# Altium project MCU.PrjPcb
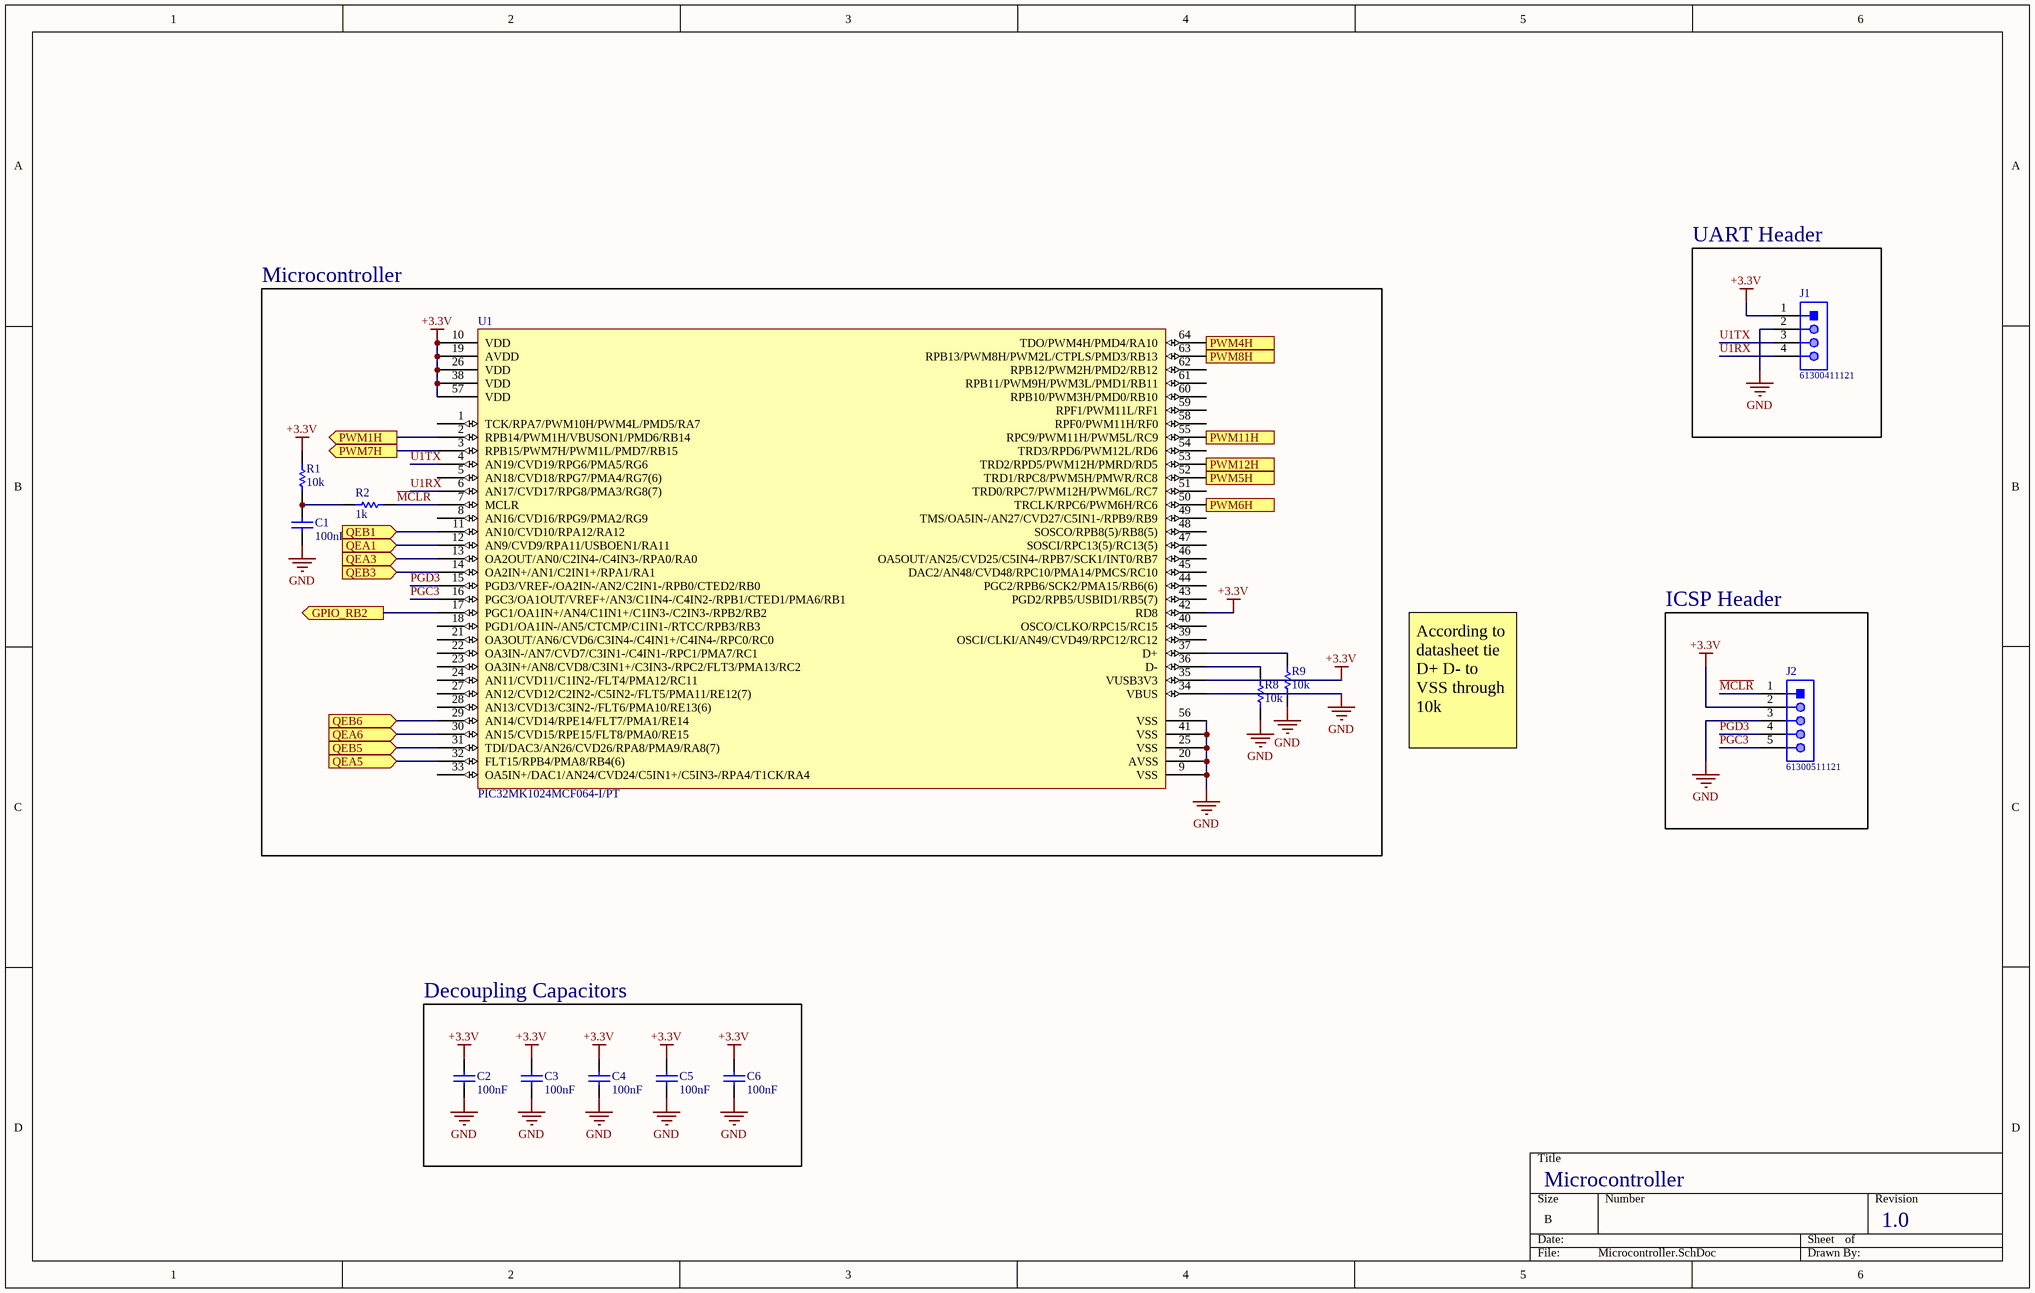
[diagram p0: Microcontroller.SchDoc]
2 sheets, 30 parts. Net scope: flat (ports and power ports of the same name join across sheets).
Board file: MCU.PcbDoc
Sheets:
  Microcontroller.SchDoc
  Motors.SchDoc

## Sheet Microcontroller.SchDoc
size B

### Parts
C1  100nF  [0402]
C2  100nF  [0402]
C3  100nF  [0402]
C4  100nF  [0402]
C5  100nF  [0402]
C6  100nF  [0402]
J1  61300411121  [61300411121]
J2  61300511121  [61300511121]
R1  10k  [0402]
R2  1k  [0402]
R8  10k  [0402]
R9  10k  [0402]
U1  PIC32MK1024MCF064-I/PT  [64-TQFP]

### Blocks framed on the sheet
UART Header: J1
Microcontroller: C1 R1 R2 R8 R9 U1
ICSP Header: J2
Decoupling Capacitors: C2-C6

### Ports
GPIO_RB2 (out), PWM1H (out), PWM4H (out), PWM5H (out), PWM6H (out), PWM7H (out), PWM8H (out), PWM11H (out), PWM12H (out), QEA1 (in), QEA3 (in), QEA5 (in), QEA6 (in), QEB1 (in), QEB3 (in), QEB5 (in), QEB6 (in)

### Nets
+3.3V: C2.2 C3.2 C4.2 C5.2 C6.2 J1.1 J2.2 R1.2 U1.10(VDD) U1.19(AVDD) U1.26(VDD) U1.35(VUSB3V3) U1.38(VDD) U1.42(RD8) U1.57(VDD)
GND: C1.1 C2.1 C3.1 C4.1 C5.1 C6.1 J1.2 J2.3 R8.1 R9.1 U1.9(VSS) U1.20(AVSS) U1.25(VSS) U1.34(VBUS) U1.41(VSS) U1.56(VSS)
~{MCLR}: J2.1 R2.2 U1.7(MCLR)
PGC3: J2.5 U1.16(PGC3/OA1OUT/VREF+/AN3/C1IN4-/C4IN2-/RPB1/CTED1/PMA6/RB1)
PGD3: J2.4 U1.15(PGD3/VREF-/OA2IN-/AN2/C2IN1-/RPB0/CTED2/RB0)
U1RX: J1.4 U1.6(AN17/CVD17/RPG8/PMA3/RG8(7))
U1TX: J1.3 U1.4(AN19/CVD19/RPG6/PMA5/RG6)
NetC1_2: C1.2 R1.1 R2.1
NetR8_2: R8.2 U1.36(D-)
NetR9_2: R9.2 U1.37(D+)
NetU1_2: U1.2(RPB14/PWM1H/VBUSON1/PMD6/RB14) ; port PWM1H
NetU1_3: U1.3(RPB15/PWM7H/PWM1L/PMD7/RB15) ; port PWM7H
NetU1_11: U1.11(AN10/CVD10/RPA12/RA12) ; port QEB1
NetU1_12: U1.12(AN9/CVD9/RPA11/USBOEN1/RA11) ; port QEA1
NetU1_13: U1.13(OA2OUT/AN0/C2IN4-/C4IN3-/RPA0/RA0) ; port QEA3
NetU1_14: U1.14(OA2IN+/AN1/C2IN1+/RPA1/RA1) ; port QEB3
NetU1_17: U1.17(PGC1/OA1IN+/AN4/C1IN1+/C1IN3-/C2IN3-/RPB2/RB2) ; port GPIO_RB2
NetU1_29: U1.29(AN14/CVD14/RPE14/FLT7/PMA1/RE14) ; port QEB6
NetU1_30: U1.30(AN15/CVD15/RPE15/FLT8/PMA0/RE15) ; port QEA6
NetU1_31: U1.31(TDI/DAC3/AN26/CVD26/RPA8/PMA9/RA8(7)) ; port QEB5
NetU1_32: U1.32(FLT15/RPB4/PMA8/RB4(6)) ; port QEA5
NetU1_50: U1.50(TRCLK/RPC6/PWM6H/RC6) ; port PWM6H
NetU1_52: U1.52(TRD1/RPC8/PWM5H/PMWR/RC8) ; port PWM5H
NetU1_53: U1.53(TRD2/RPD5/PWM12H/PMRD/RD5) ; port PWM12H
NetU1_55: U1.55(RPC9/PWM11H/PWM5L/RC9) ; port PWM11H
NetU1_63: U1.63(RPB13/PWM8H/PWM2L/CTPLS/PMD3/RB13) ; port PWM8H
NetU1_64: U1.64(TDO/PWM4H/PMD4/RA10) ; port PWM4H

Not connected (* = marked no-connect by the designer): U1 1(TCK/RPA7/PWM10H/PWM4L/PMD5/RA7) 5(AN18/CVD18/RPG7/PMA4/RG7(6)) 8(AN16/CVD16/RPG9/PMA2/RG9) 18(PGD1/OA1IN-/AN5/CTCMP/C1IN1-/RTCC/RPB3/RB3) 21(OA3OUT/AN6/CVD6/C3IN4-/C4IN1+/C4IN4-/RPC0/RC0) 22(OA3IN-/AN7/CVD7/C3IN1-/C4IN1-/RPC1/PMA7/RC1) 23(OA3IN+/AN8/CVD8/C3IN1+/C3IN3-/RPC2/FLT3/PMA13/RC2) 24(AN11/CVD11/C1IN2-/FLT4/PMA12/RC11) 27(AN12/CVD12/C2IN2-/C5IN2-/FLT5/PMA11/RE12(7)) 28(AN13/CVD13/C3IN2-/FLT6/PMA10/RE13(6)) 33(OA5IN+/DAC1/AN24/CVD24/C5IN1+/C5IN3-/RPA4/T1CK/RA4) 39(OSCI/CLKI/AN49/CVD49/RPC12/RC12) 40(OSCO/CLKO/RPC15/RC15) 43(PGD2/RPB5/USBID1/RB5(7)) 44(PGC2/RPB6/SCK2/PMA15/RB6(6)) 45(DAC2/AN48/CVD48/RPC10/PMA14/PMCS/RC10) 46(OA5OUT/AN25/CVD25/C5IN4-/RPB7/SCK1/INT0/RB7) 47(SOSCI/RPC13(5)/RC13(5)) 48(SOSCO/RPB8(5)/RB8(5)) 49(TMS/OA5IN-/AN27/CVD27/C5IN1-/RPB9/RB9) 51(TRD0/RPC7/PWM12H/PWM6L/RC7) 54(TRD3/RPD6/PWM12L/RD6) 58(RPF0/PWM11H/RF0) 59(RPF1/PWM11L/RF1) 60(RPB10/PWM3H/PMD0/RB10) 61(RPB11/PWM9H/PWM3L/PMD1/RB11) 62(RPB12/PWM2H/PMD2/RB12)

### Notes on the sheet
- According to datasheet tie D+ D- to VSS through 10k
- Microcontroller
- 1.0

### Library data of the parts
C1-C6 = C1005X7R1C104K050BC: TDK - C1005X7R1C104K050BC. - CERAMIC CAPACITOR, 0.1UF, 16V, X7R, 10%, 0402, FULL REEL; Part Name: C1005X7R1C104K050BC; Supplier 1: Digi-Key; Supplier Part Number 1: 445-4952-1-ND; Manufacturer: TDK; Manufacturer Part Number: C1005X7R1C104K050BC; RoHS: Yes; Category: Ceramic Capacitors; Stock 1: 2957810; Pricing 1: 1=0.10000, 10=0.07500, 100=0.03350, 500=0.02390, 1000=0.01879, 2500=0.01708, 5000=0.01571 (USD); Mount: Surface Mount; Case/Package: 0402; Min Operating Temperature: -55°C; Max Operating Temperature: 125°C; Termination: SMD/SMT; Voltage: 16V; Tolerance: 10%; Capacitance: 100nF; Packaging: Tape and Reel; Voltage Rating: 16V; Package Quantity: 1; Voltage Rating (DC): 16V; Length: 1mm; Height: 0.5mm; Radiation Hardening: No; REACH SVHC: Unknown; Number of Pins: 2; Weight: 2.3E-05oz; Case Code (Metric): 1005; Case Code (Imperial): 0402; Dielectric Material: Ceramic; Dielectric: X7R; Composition: Ceramic; Depth: 0.5mm; Thickness: 0.022inch; Width: 0.02inch; Lead Free: Lead Free
J1 = CMP-1502-01064-1: THT Vertical Pin Header WR-PHD, Pitch 2.54 mm, Single Row, 4 pins; Manufacturer: Wurth Elektronik; Withstanding Voltage: 500VAC; Rated Current: 3A; Working Voltage: 250VAC; Pin Number: 4; Gender: Male; Contact Resistance: 20mOhm; Pitch: 2.54mm; Manufacturer URL: http://www.we-online.de; Operating Temperature: -40to105degC; Packaging: Bag; Mounting Technology: THT; Package Reference: 61300411121; Datasheet URL: https://katalog.we-online.de/em/datasheet/6130xx11121.pdf; Publisher: WurthElektronik; Part Number: 61300411121; Row Number: Single; Orientation: Vertical
J2 = CMP-1502-01068-1: THT Vertical Pin Header WR-PHD, Pitch 2.54 mm, Single Row, 5 pins; Manufacturer: Wurth Elektronik; Pin Number: 5; Contact Resistance: 20mOhm; Working Voltage: 250VAC; Pitch: 2.54mm; Withstanding Voltage: 500VAC; Rated Current: 3A; Gender: Male; Datasheet URL: https://katalog.we-online.de/em/datasheet/6130xx11121.pdf; Orientation: Vertical; Mounting Technology: THT; Row Number: Single; Package Reference: 61300511121; Publisher: WurthElektronik; Part Number: 61300511121; Packaging: Bag; Manufacturer URL: http://www.we-online.de; Operating Temperature: -40to105degC
R1 R8 R9 = CRCW040210K0FKEDC: D10/CRCW0402-C 100 10K 1% ET7; Manufacturer: Vishay; Power Rating: 62.5mW; Temperature Coefficient: 100ppm/°C; Part Name: CRCW040210K0FKEDC; Supplier 1: Digi-Key; Supplier Part Number 1: 541-3959-6-ND; Manufacturer Part Number: CRCW040210K0FKEDC; RoHS: Yes; Category: Resistors; Stock 1: 3541307; Pricing 1: 1=0.10000, 10=0.03200, 100=0.01300, 1000=0.00583, 2500=0.00506, 5000=0.00418 (USD); Case/Package: Molded; Contact Plating: Tin; Min Operating Temperature: -55°C; Max Operating Temperature: 155°C; Tolerance: 1%; Termination: Wraparound; Resistance: 10k; Composition: Thick Film; Length: 1mm; Lead Free: Lead Free
R2 = CRCW04021K00FKED: Res Thick Film 0402 1K Ohm 1% 1/16W ±100ppm/°C Molded SMD Paper T/R; Manufacturer: Vishay Dale; Part Name: CRCW04021K00FKED; Supplier 1: Digi-Key; Supplier Part Number 1: 541-1.00KLDKR-ND; Manufacturer Part Number: CRCW04021K00FKED; RoHS: Yes; Category: Chip SMD Resistors; Stock 1: 767306; Pricing 1: 1=0.10000, 10=0.03600, 100=0.01460, 1000=0.00657, 2500=0.00570, 5000=0.00471 (USD); Tolerance: 1%; Resistance: 1k
U1 = PIC32MK1024MCF064-I/PT: IC MCU 32BIT 1MB FLASH 64TQFP; Manufacturer: Microchip; Part Name: PIC32MK1024MCF064-I/PT; Supplier 1: Digi-Key; Supplier Part Number 1: PIC32MK1024MCF064-I/PT-ND; Manufacturer Part Number: PIC32MK1024MCF064-I/PT; RoHS: No; Category: Microcontrollers; Stock 1: 2; Pricing 1: 1=7.30000, 25=6.70000, 100=6.06000 (USD); ComponentLink1URL: http://www.farnell.com/datasheets/2302007.pdf?src-supplier=Farnell; ComponentLink1Description: http://www.farnell.com/datasheets/2302007.pdf?src-supplier=Farnell; ComponentLink2URL: http://www.microchip.com/mymicrochip/filehandler.aspx?ddocname=en597535&src-supplier=Digi-Key; ComponentLink2Description: http://www.microchip.com/mymicrochip/filehandler.aspx?ddocname=en597535&src-supplier=Digi-Key

## Sheet Motors.SchDoc
size B
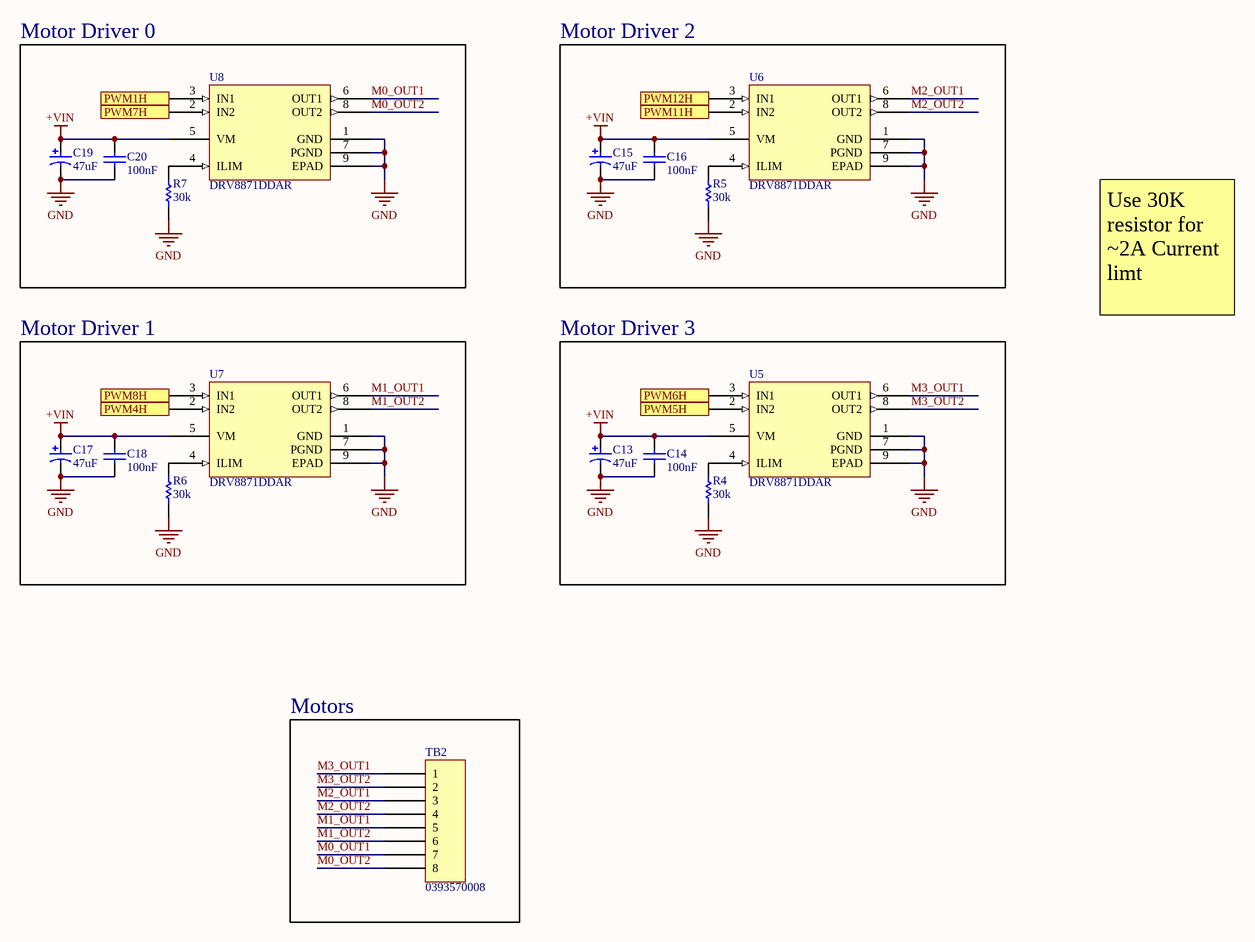
[diagram p1: Motors.SchDoc]

### Parts
C13  47uF  [EEE-FT1C470AR]
C14  100nF  [0402]
C15  47uF  [EEE-FT1C470AR]
C16  100nF  [0402]
C17  47uF  [EEE-FT1C470AR]
C18  100nF  [0402]
C19  47uF  [EEE-FT1C470AR]
C20  100nF  [0402]
R4  30k  [0402]
R5  30k  [0402]
R6  30k  [0402]
R7  30k  [0402]
TB2  0393570008  [0393570008]
U5  DRV8871DDAR  [8-HSOP]
U6  DRV8871DDAR  [8-HSOP]
U7  DRV8871DDAR  [8-HSOP]
U8  DRV8871DDAR  [8-HSOP]

### Blocks framed on the sheet
Motor Driver 0: C19 C20 R7 U8
Motor Driver 2: C15 C16 R5 U6
Motor Driver 1: C17 C18 R6 U7
Motor Driver 3: C13 C14 R4 U5
Motors: TB2

### Ports
PWM1H (in), PWM4H (in), PWM5H (in), PWM6H (in), PWM7H (in), PWM8H (in), PWM11H (in), PWM12H (in)

### Nets
+VIN: C13.1 C14.2 C15.1 C16.2 C17.1 C18.2 C19.1 C20.2 U5.5(VM) U6.5(VM) U7.5(VM) U8.5(VM)
GND: C13.2 C14.1 C15.2 C16.1 C17.2 C18.1 C19.2 C20.1 R4.1 R5.1 R6.1 R7.1 U5.1(GND) U5.7(PGND) U5.9(EPAD) U6.1(GND) U6.7(PGND) U6.9(EPAD) U7.1(GND) U7.7(PGND) U7.9(EPAD) U8.1(GND) U8.7(PGND) U8.9(EPAD)
M0_OUT1: TB2.7 U8.6(OUT1)
M0_OUT2: TB2.8 U8.8(OUT2)
M1_OUT1: TB2.5 U7.6(OUT1)
M1_OUT2: TB2.6 U7.8(OUT2)
M2_OUT1: TB2.3 U6.6(OUT1)
M2_OUT2: TB2.4 U6.8(OUT2)
M3_OUT1: TB2.1 U5.6(OUT1)
M3_OUT2: TB2.2 U5.8(OUT2)
NetR4_2: R4.2 U5.4(ILIM)
NetR5_2: R5.2 U6.4(ILIM)
NetR6_2: R6.2 U7.4(ILIM)
NetR7_2: R7.2 U8.4(ILIM)
NetU1_2: U8.3(IN1) ; port PWM1H
NetU1_3: U8.2(IN2) ; port PWM7H
NetU1_50: U5.3(IN1) ; port PWM6H
NetU1_52: U5.2(IN2) ; port PWM5H
NetU1_53: U6.3(IN1) ; port PWM12H
NetU1_55: U6.2(IN2) ; port PWM11H
NetU1_63: U7.3(IN1) ; port PWM8H
NetU1_64: U7.2(IN2) ; port PWM4H

### Notes on the sheet
- Use 30K resistor for ~2A Current limt
- Title
- Size:
- Date:
- B
- Number:
- Time:
- Revision:
- Sheet
- of
- File:

### Library data of the parts
C13 C15 C17 C19 = EEE-FT1C470AR: PANASONIC - EEEFT1C470AR - SMD Aluminium Electrolytic Capacitor, Radial Can - SMD, 47 µF, 16 V, 0.85 ohm, FT Series; Polarity: Polar; Voltage: 16V; Leakage Current: 7.5uA; Life (Hours): 2000Hour; Tolerance: 20%; Ripple Current: 160mA; ESR (Equivalent Series Resistance): 850mR; Lead Diameter: 0.65mm; Part Name: EEE-FT1C470AR; Supplier 1: Digi-Key; Supplier Part Number 1: P15090CT-ND; Manufacturer: Panasonic; Manufacturer Part Number: EEEFT1C470AR; RoHS: Yes; Category: Aluminum Electrolytic Capacitors; Stock 1: 48806; Pricing 1: 1=0.42000, 10=0.29800, 100=0.19590, 500=0.14514, 1000=0.12337 (USD); Mount: Surface Mount; Case/Package: Radial; Contact Plating: Tin; Min Operating Temperature: -55°C; Max Operating Temperature: 105°C; Termination: SMD/SMT; Capacitance: 47uF; Packaging: Tape and Reel; Voltage Rating: 16V; Ripple Current (AC): 160mA; Package Quantity: 2000; Voltage Rating (DC): 16V; Diameter: 4mm; Length: 5.8mm; Height: 5.8mm; Lead Pitch: 1mm; Height - Seated (Max): 0.24inch; Radiation Hardening: No; REACH SVHC: No SVHC
C14 C16 C18 C20 = C1005X7R1C104K050BC: as C1 on sheet Microcontroller; Part Name: C1005X7R1C104K050BC; Supplier 1: Digi-Key; Supplier Part Number 1: 445-4952-1-ND; Manufacturer: TDK; Manufacturer Part Number: C1005X7R1C104K050BC; RoHS: Yes; Category: Ceramic Capacitors; Stock 1: 2957810; Pricing 1: 1=0.10000, 10=0.07500, 100=0.03350, 500=0.02390, 1000=0.01879, 2500=0.01708, 5000=0.01571 (USD); Mount: Surface Mount; Case/Package: 0402; Min Operating Temperature: -55°C; Max Operating Temperature: 125°C; Termination: SMD/SMT; Voltage: 16V; Tolerance: 10%; Capacitance: 100nF; Packaging: Tape and Reel; Voltage Rating: 16V; Package Quantity: 1; Voltage Rating (DC): 16V; Length: 1mm; Height: 0.5mm; Radiation Hardening: No; REACH SVHC: Unknown; Number of Pins: 2; Weight: 2.3E-05oz; Case Code (Metric): 1005; Case Code (Imperial): 0402; Dielectric Material: Ceramic; Dielectric: X7R; Composition: Ceramic; Depth: 0.5mm; Thickness: 0.022inch; Width: 0.02inch; Lead Free: Lead Free
R4-R7 = CRCW040230K0FKED: Res Thick Film 0402 30K Ohm 1% 0.063W(1/16W) ±100ppm/C Molded SMD Automotive Paper T/R; Manufacturer: Vishay; Power Rating: 63mW; Temperature Coefficient: 100ppm/°C; Voltage Rating: 50V; Part Name: CRCW040230K0FKED; Supplier 1: Digi-Key; Supplier Part Number 1: 541-30.0KLCT-ND; Manufacturer Part Number: CRCW040230K0FKED; RoHS: Yes; Category: Chip SMD Resistors; Stock 1: 3845; Pricing 1: 1=0.10000, 10=0.03600, 100=0.01460, 1000=0.00657, 2500=0.00570, 5000=0.00471 (USD); Case/Package: 0402; Weight: 2.3E-05oz; Case Code (Metric): 1005; Case Code (Imperial): 0402; Contact Plating: Tin; Min Operating Temperature: -55°C; Max Operating Temperature: 155°C; Packaging: Tape and Reel; Tolerance: 1%; Termination: SMD/SMT; Package Quantity: 10000; Resistance: 30k; Military Standard: Not; Composition: Thick Film; Max Power Dissipation: 63mW; Number of Terminations: 2; Voltage Rating (DC): 50V; Length: 1mm; Height: 0.35mm; Width: 0.5mm; Depth: 0.5mm; Radiation Hardening: No; Lead Free: Lead Free
TB2 = 0393570008: Conn Eurostyle Block 8 POS 3.5mm Solder ST Thru-Hole 17.5A/Contact; Manufacturer: Molex; Number of Contacts: 8; Max Voltage Rating (AC): 300V; Wire Gauge (Max): 28AWG; Wire Gauge (Min): 16AWG; Plating: Nickel; Number of Levels: 1; Current: 12A; Part Name: 0393570008; Supplier 1: Digi-Key; Supplier Part Number 1: 23-0393570008-ND; Manufacturer Part Number: 0393570008; RoHS: Yes; Category: Terminal Blocks; Stock 1: 351; Pricing 1: 1=3.02000, 10=2.29800, 25=2.15280, 50=1.91360, 100=1.87200, 250=1.72640, 500=1.56000, 1000=1.38320, 5000=1.30000 (USD); Mount: Through Hole; Contact Plating: Tin; Contact Material: Copper; Housing Color: Black; Housing Material: Polyamide; Min Operating Temperature: -30°C; Max Operating Temperature: 85°C; Packaging: Bulk; Number of Rows: 1; Termination: Solder; Orientation: Straight; Max Supply Voltage (AC): 300V; Length: 28mm; Pitch: 3.5mm; Depth: 7.29mm; ComponentLink1URL: http://components.arrow.com/part/dataview/0323_07191186?src-supplier=Arrow+Europe; ComponentLink1Description: http://components.arrow.com/part/dataview/0323_07191186?src-supplier=Arrow+Europe; ComponentLink2URL: http://components.arrow.com/part/dataview/42878979S8737925N3303?src-supplier=Arrow; ComponentLink2Description: http://components.arrow.com/part/dataview/42878979S8737925N3303?src-supplier=Arrow; Color: Black; Number of Positions Per Level: 8; Voltage: 300V; Radiation Hardening: No
U5-U8 = DRV8871DDAR: IC BRUSHED DC MOTOR 8SOIC; Manufacturer: Texas Instruments; Interface: PWM; Max Output Current: 3.6A; Fault Protection: Over Temperature; Part Name: DRV8871DDAR; Supplier 1: Digi-Key; Supplier Part Number 1: 296-43024-1-ND; Manufacturer Part Number: DRV8871DDAR; RoHS: Yes; Category: Embedded Processors and Controllers; Stock 1: 10035; Pricing 1: 1=1.87000, 10=1.67900, 25=1.58360, 100=1.26690, 250=1.10852, 500=1.07686, 1000=0.85516 (USD); Min Operating Temperature: -40°C; Max Operating Temperature: 125°C; Packaging: Tape and Reel; ComponentLink1URL: http://www.ti.com/lit/pdf/slyb165?src-supplier=Digi-Key; ComponentLink1Description: http://www.ti.com/lit/pdf/slyb165?src-supplier=Digi-Key; ComponentLink2URL: http://www.ti.com/lit/ds/symlink/drv8871.pdf?src-supplier=Digi-Key; ComponentLink2Description: http://www.ti.com/lit/ds/symlink/drv8871.pdf?src-supplier=Digi-Key; Mount: Surface Mount; Lead Free: Lead Free

## Nets that join several sheets
GND: Microcontroller (16 pins), Motors (24 pins)
NetU1_2: Microcontroller (U1.2), Motors (U8.3)
NetU1_3: Microcontroller (U1.3), Motors (U8.2)
NetU1_50: Microcontroller (U1.50), Motors (U5.3)
NetU1_52: Microcontroller (U1.52), Motors (U5.2)
NetU1_53: Microcontroller (U1.53), Motors (U6.3)
NetU1_55: Microcontroller (U1.55), Motors (U6.2)
NetU1_63: Microcontroller (U1.63), Motors (U7.3)
NetU1_64: Microcontroller (U1.64), Motors (U7.2)